# Altium schematic sheet audio.SchDoc
size A4
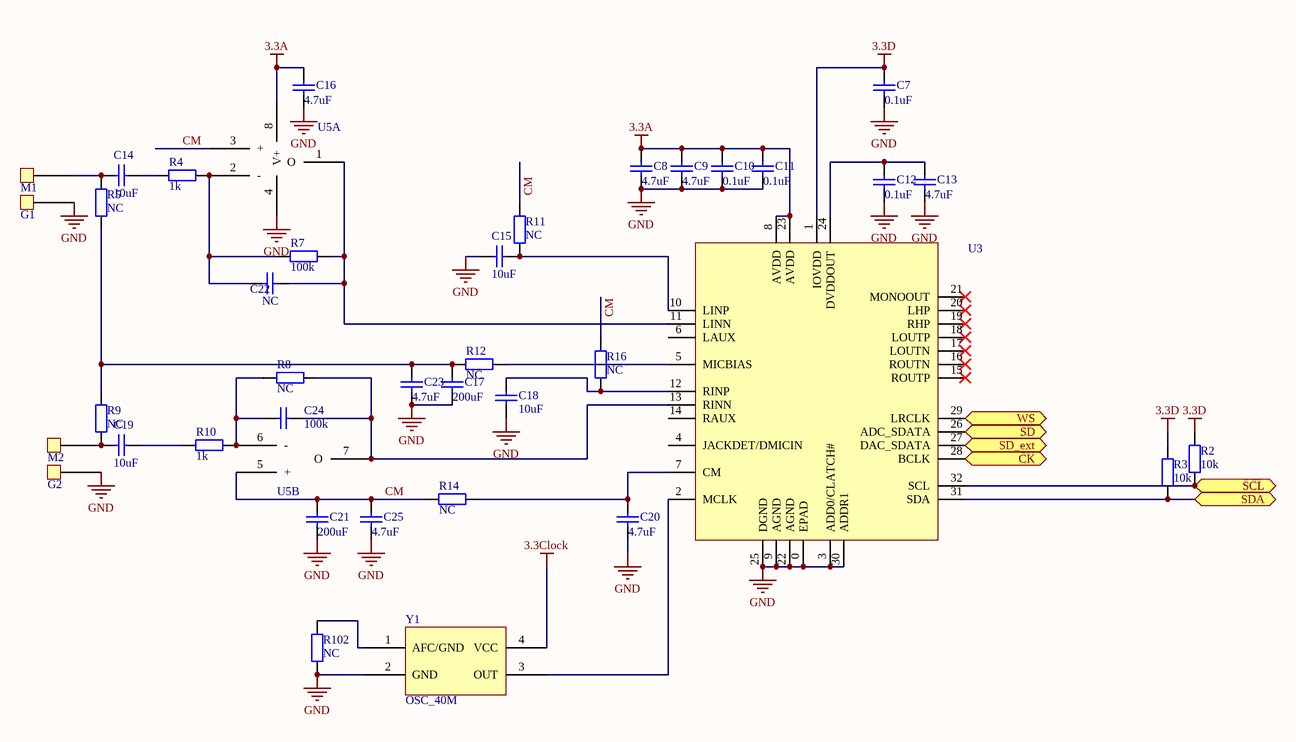
[diagram p0: audio.SchDoc]

## Parts
C7  0.1uF  [0402]
C8  4.7uF  [0805]
C9  4.7uF  [0805]
C10  0.1uF  [0402]
C11  0.1uF  [0402]
C12  0.1uF  [0402]
C13  4.7uF  [0805]
C14  10uF  [0805]
C15  10uF  [0805]
C16  4.7uF  [0402]
C17  200uF  [1210]
C18  10uF  [0805]
C19  10uF  [0805]
C20  4.7uF  [0805]
C21  200uF  [1210]
C22  NC  [0402]
C23  4.7uF  [0805]
C24  100k  [0402]
C25  4.7uF  [0805]
G1  TestPad  [TestPad]  (value not drawn)
G2  TestPad  [TestPad]  (value not drawn)
M1  TestPad  [TestPad]  (value not drawn)
M2  TestPad  [TestPad]  (value not drawn)
R2  value 10k  [0402]  (hidden comment: Res2)
R3  value 10k  [0402]  (hidden comment: Res2)
R4  1k  [0402]
R5  NC  [0402]
R7  100k  [0402]
R8  NC  [0402]
R9  NC  [0402]
R10  1k  [0402]
R11  NC  [0402]
R12  NC  [0402]
R14  NC  [0402]
R16  NC  [0402]
R102  NC  [0402]
U3  ADAU1761  [ADAU1761]  (value not drawn)
U5  OP-2  [SO8]  (value not drawn)  (parts A,B of 2)
Y1  OSC_40M  [TXC_7Q]

## Ports
CK, SCL, SD, SD_ext, SDA, WS

## Nets
3.3A: C8.2 C9.2 C10.2 C11.2 C16.2 U3.8(AVDD) U3.23(AVDD) U5.8(V+)
3.3Clock: Y1.4(VCC)
3.3D: C7.2 R2.2 R3.2 U3.1(IOVDD)
GND: C7.1 C8.1 C9.1 C10.1 C11.1 C12.1 C13.1 C15.2 C16.1 C17.1 C18.1 C20.1 C21.1 C23.1 C25.1 G1.1 G2.1 R102.2 U3.0(EPAD) U3.3(ADD0/CLATCH#) U3.9(AGND) U3.22(AGND) U3.25(DGND) U3.30(ADDR1) U5.4 Y1.2(GND)
CK: U3.28(BCLK) ; port CK
CM: C21.2 C25.2 R11.1 R14.2 R16.1 U5.3(+) U5.5(+)
SCL: R2.1 U3.32(SCL) ; port SCL
SD: U3.26(ADC_SDATA) ; port SD
SD_ext: U3.27(DAC_SDATA) ; port SD_ext
SDA: R3.1 U3.31(SDA) ; port SDA
WS: U3.29(LRCLK) ; port WS
NetC12_2: C12.2 C13.2 U3.24(DVDDOUT)
NetC14_1: C14.1 R4.1
NetC14_2: C14.2 M1.1 R5.2
NetC15_1: C15.1 R11.2 U3.10(LINP)
NetC17_2: C17.2 C23.2 R5.1 R9.2 R12.2
NetC18_2: C18.2 R16.2 U3.12(RINP)
NetC19_1: C19.1 R10.1
NetC19_2: C19.2 M2.1 R9.1
NetC20_2: C20.2 R14.1 U3.7(CM)
NetC22_1: C22.1 R7.2 U3.11(LINN) U5.1(O)
NetC22_2: C22.2 R4.2 R7.1 U5.2(-)
NetC24_1: C24.1 R8.2 U3.13(RINN) U5.7(O)
NetC24_2: C24.2 R8.1 R10.2 U5.6(-)
NetR12_1: R12.1 U3.5(MICBIAS)
NetR102_1: R102.1 Y1.1(AFC/GND)
NetU3_2: U3.2(MCLK) Y1.3(OUT)

Not connected (* = marked no-connect by the designer): U3 4(JACKDET/DMICIN) 6(LAUX) 14(RAUX) 15(ROUTP)* 16(ROUTN)* 17(LOUTN)* 18(LOUTP)* 19(RHP)* 20(LHP)* 21(MONOOUT)*

## Library data of the parts
C7-C25 = Cap: Capacitor; Published: 8-Jun-2000; LatestRevisionDate: 17-Jul-2002; LatestRevisionNote: Re-released for DXP Platform.; PackageReference: RAD-0.3; Publisher: Altium Limited; PackageDescription: Radial Cap, Thru-Hole; 2 Leads; 0.3 in Pin Spacing
R2-R5 R7-R12 R14 R16 R102 = Res2: Resistor; Published: 8-Jun-2000; LatestRevisionDate: 17-Jul-2002; LatestRevisionNote: Re-released for DXP Platform.; PackageReference: AXIAL-0.4; Publisher: Altium Limited; PackageDescription: Axial Device, Thru-Hole; 2 Leads; 0.4 in Pin Spacing